# Altium schematic sheet TOP.SchDoc
size A4; Organization: Altium Limited; Address1: L3, 12a Rodborough Rd; Address2: Frenchs Forest; Address3: NSW; Address4: Australia 2086
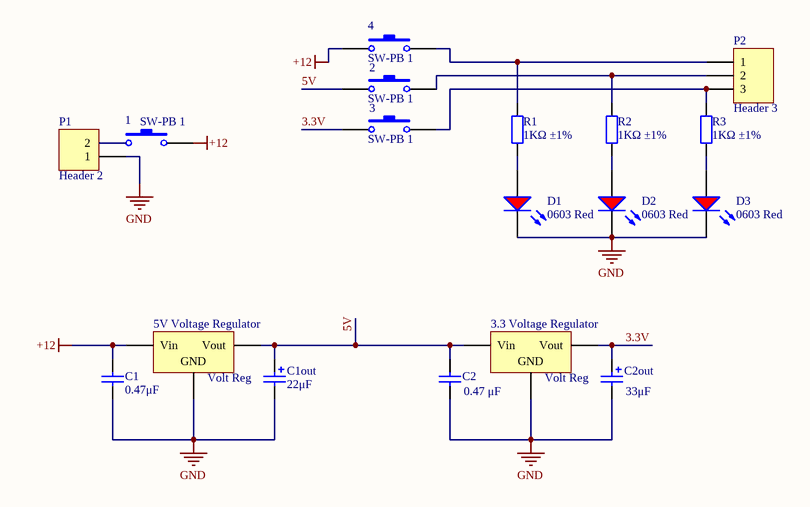
[diagram p0: TOP.SchDoc]

## Parts
1  SW-PB 1  [SPST-2]
2  SW-PB 1  [SPST-2]
3  SW-PB 1  [SPST-2]
3.3_Voltage_Regulator  Volt Reg  [D2PAK_N]
4  SW-PB 1  [SPST-2]
5V_Voltage_Regulator  Volt Reg  [D2PAK_N]
C1  value 0.47μF  [RAD-0.3]
C1out  value 22μF  [POLAR0.8]
C2  value 0.47 μF  [RAD-0.3]
C2out  value 33μF  [POLAR0.8]
D1  0603 Red  [0603_LED_S1]
D2  0603 Red  [0603_LED_S1]
D3  0603 Red  [0603_LED_S1]
P1  Header 2  [HDR1X2]
P2  Header 3  [HDR1X3]
R1  1KΩ ±1%  [0402_R]
R2  1KΩ ±1%  [0402_R]
R3  1KΩ ±1%  [0402_R]

## Nets
+12: 1.2 4.1 5V_Voltage_Regulator.1(Vin) C1.2
GND: 3.3_Voltage_Regulator.2(GND) 5V_Voltage_Regulator.2(GND) C1.1 C1out.2 C2.1 C2out.2 D1.K D2.K D3.K P1.1
3.3V: 3.1 3.3_Voltage_Regulator.3(Vout) C2out.1
5V: 2.1 3.3_Voltage_Regulator.1(Vin) 5V_Voltage_Regulator.3(Vout) C1out.1 C2.2
Net1_1: 1.1 P1.2
Net2_2: 2.2 P2.2 R2.2
Net3_2: 3.2 P2.3 R3.2
Net4_2: 4.2 P2.1 R1.2
NetD1_A: D1.A R1.1
NetD2_A: D2.A R2.1
NetD3_A: D3.A R3.1

## Notes on the sheet
- Title
- Size:
- Date:
- A4
- Number:
- Time:
- Revision:
- Sheet
- of
- File:

## Library data of the parts
1-4 = SW-PB: Switch; Published: 24-Mar-1999; LatestRevisionDate: 17-Jul-2002; LatestRevisionNote: Re-released for DXP Platform.; PackageReference: SPST-2; Publisher: Altium Limited; PackageDescription: Switch; 2 Leads
3.3_Voltage_Regulator 5V_Voltage_Regulator = Volt Reg: Voltage Regulator; Published: 24-Mar-1999; LatestRevisionDate: 29-May-2009; LatestRevisionNote: IPC-7351 Footprint Added.; PackageReference: D2PAK; Publisher: Altium Limited; PackageDescription: 3-Pin Transistor Outline Package 2.54 mm Pitch, 15.1 mm Lead Span
C1 C2 = Cap: Capacitor; Published: 8-Jun-2000; LatestRevisionDate: 17-Jul-2002; LatestRevisionNote: Re-released for DXP Platform.; PackageReference: RAD-0.3; Publisher: Altium Limited; PackageDescription: Radial Cap, Thru-Hole; 2 Leads; 0.3 in Pin Spacing
C1out C2out = Cap Pol2: Polarized Capacitor (Axial); Published: 8-Jun-2000; LatestRevisionDate: 17-Jul-2002; LatestRevisionNote: Re-released for DXP Platform.; PackageReference: POLAR0.8; Publisher: Altium Limited; PackageDescription: Polarized Capacitor; 2 Leads
D1-D3 = 0603 LED Red: LED; ComponentLink1Description: 供应商链接; ComponentLink1URL: http://www.szlcsc.com/product/details_2659.html; Package: 0603; Supplier: LC; SuppliersPartNumber: C2286; Color: Red
P1 = Header 2: Header, 2-Pin; LatestRevisionDate: 17-Jul-2002; LatestRevisionNote: Re-released for DXP Platform.; Publisher: Altium Limited
P2 = Header 3: Header, 3-Pin; LatestRevisionDate: 17-Jul-2002; LatestRevisionNote: Re-released for DXP Platform.; Publisher: Altium Limited
R1-R3 = 0402 1K (1001) 1%: Chip resistor; Manufacturer: Uniroyal Elec; PartNumber: 0402WGF1001TCE; Power: 1/16W; ComponentLink1Description: Supplier link; ComponentLink1URL: http://www.szlcsc.com/product/details_12256.html; Package: 0402; Supplier: LC; SuppliersPartNumber: C11702; Resistance: 1KΩ; Tolerance: 1%